# Altium schematic sheet FG28X7R1H104KNT061_FG28X7R1H104KNT06.schdoc
size 127 x 101 mm
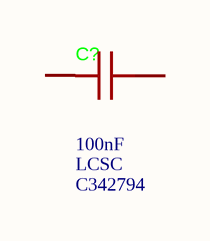
[diagram p0: FG28X7R1H104KNT061_FG28X7R1H104KNT06.schdoc]

## Parts
C?  Supplier: LCSC  Supplier Part: C342794  [CAP-TH_L4.0-W2.5-P5.00-D1.0]  (hidden comment: 100nF)

## Nets

Not connected (* = marked no-connect by the designer): C? 1 2

## Library data of the parts
C? = FG28X7R1H104KNT06: Manufacturer: TDK; Add into BOM: yes; Tolerance: ±10%; Voltage Rating: 50V; Temperature Coefficient: X7R; Pin Spacing: 5mm; Symbol: FG28X7R1H104KNT06; Device: FG28X7R1H104KNT06; Value: 100nF; LCSC Part Name: 100nF ±10% 50V; Manufacturer Part: FG28X7R1H104KNT06; Supplier Footprint: 插件,P=5mm; JLCPCB Part Class: Extended Part; Datasheet: https://item.szlcsc.com/datasheet/FG28X7R1H104KNT06/319644.html; Convert to PCB: yes